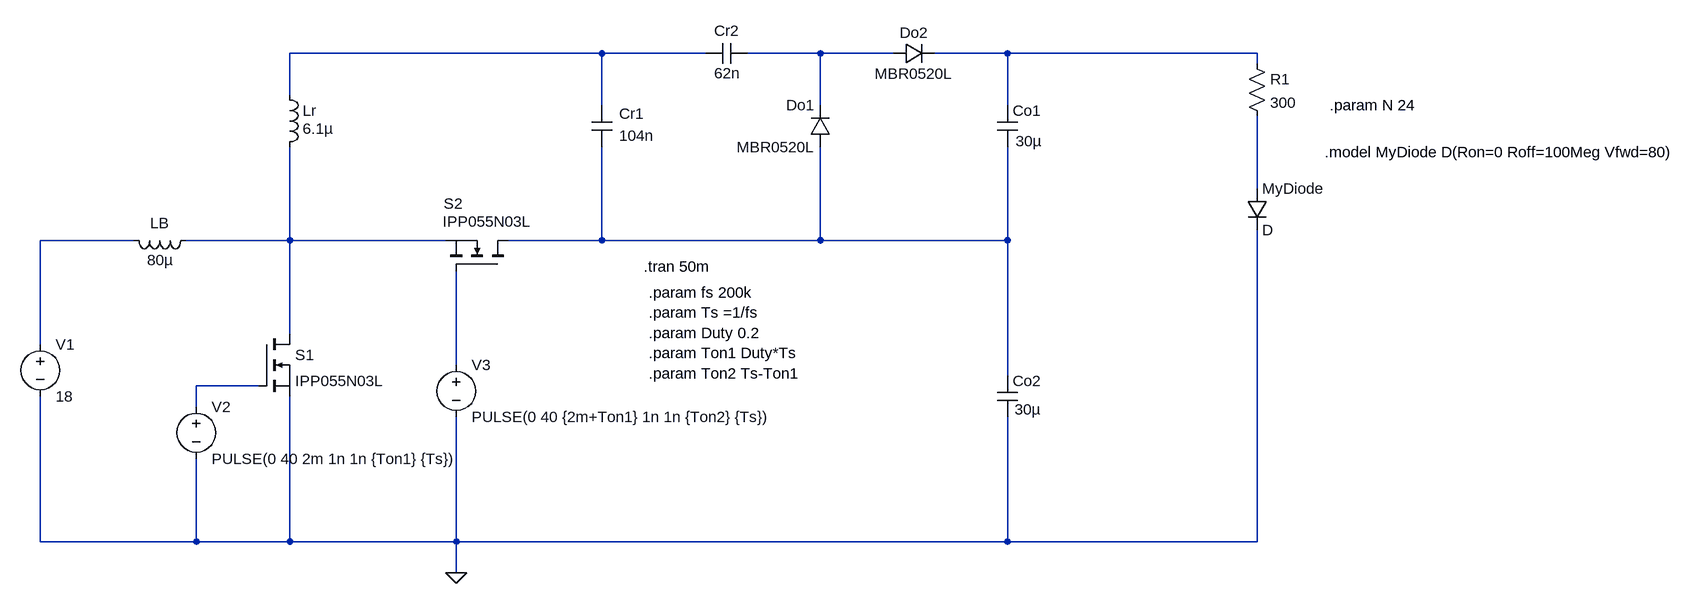
[diagram p0: schematic reale.asc]
reale.asc, the LTspice schematic file:
Version 4.1
SHEET 1 2452 2144
WIRE 352 -128 -128 -128
WIRE 512 -128 352 -128
WIRE 688 -128 576 -128
WIRE 800 -128 688 -128
WIRE 976 -128 864 -128
WIRE 1360 -128 976 -128
WIRE 1360 -112 1360 -128
WIRE -128 -64 -128 -128
WIRE 352 -48 352 -128
WIRE 688 -48 688 -128
WIRE 976 -48 976 -128
WIRE 1360 80 1360 -32
WIRE -368 160 -512 160
WIRE -128 160 -128 16
WIRE -128 160 -288 160
WIRE 112 160 -128 160
WIRE 352 160 352 16
WIRE 352 160 208 160
WIRE 688 160 688 16
WIRE 688 160 352 160
WIRE 976 160 976 16
WIRE 976 160 688 160
WIRE -128 304 -128 160
WIRE -512 320 -512 160
WIRE 128 352 128 208
WIRE 976 368 976 160
WIRE -176 384 -272 384
WIRE -272 416 -272 384
WIRE -512 624 -512 400
WIRE -272 624 -272 496
WIRE -272 624 -512 624
WIRE -128 624 -128 400
WIRE -128 624 -272 624
WIRE 128 624 128 432
WIRE 128 624 -128 624
WIRE 976 624 976 432
WIRE 976 624 128 624
WIRE 1360 624 1360 144
WIRE 1360 624 976 624
WIRE 128 672 128 624
FLAG 128 672 0
SYMBOL cap 336 -48 R0
WINDOW 0 43 13 Left 2
WINDOW 3 43 47 Left 2
SYMATTR InstName Cr1
SYMATTR Value 104n
SYMBOL cap 576 -144 R90
WINDOW 0 -3 32 VBottom 2
WINDOW 3 62 31 VBottom 2
SYMATTR InstName Cr2
SYMATTR Value 62n
SYMBOL cap 960 -48 R0
WINDOW 3 29 55 Left 2
SYMATTR Value 30µ
SYMATTR InstName Co1
SYMBOL cap 960 368 R0
WINDOW 3 27 52 Left 2
SYMATTR Value 30µ
SYMATTR InstName Co2
SYMBOL ind -144 -80 R0
WINDOW 3 36 68 Left 2
SYMATTR Value 6.1µ
SYMATTR InstName Lr
SYMBOL ind -272 144 R90
WINDOW 0 5 56 VBottom 2
WINDOW 3 62 55 VBottom 2
SYMATTR InstName LB
SYMATTR Value 80µ
SYMBOL voltage -512 304 R0
WINDOW 123 0 0 Left 0
WINDOW 39 0 0 Left 0
SYMATTR InstName V1
SYMATTR Value 18
SYMBOL diode 704 16 R180
WINDOW 0 24 64 Left 2
WINDOW 3 24 0 Left 2
SYMATTR InstName Do1
SYMATTR Value MBR0520L
SYMBOL nmos -176 304 R0
SYMATTR InstName S1
SYMATTR Value IPP055N03L
SYMBOL nmos 208 208 M270
WINDOW 0 105 99 VLeft 2
WINDOW 3 77 101 VLeft 2
SYMATTR InstName S2
SYMATTR Value IPP055N03L
SYMBOL diode 800 -112 R270
WINDOW 0 32 32 VTop 2
WINDOW 3 0 32 VBottom 2
SYMATTR InstName Do2
SYMATTR Value MBR0520L
SYMBOL voltage -272 400 R0
WINDOW 123 0 0 Left 0
WINDOW 39 0 0 Left 0
SYMATTR InstName V2
SYMATTR Value PULSE(0 40 2m 1n 1n {Ton1} {Ts})
SYMBOL voltage 128 336 R0
WINDOW 123 0 0 Left 0
WINDOW 39 0 0 Left 0
SYMATTR InstName V3
SYMATTR Value PULSE(0 40 {2m+Ton1} 1n 1n {Ton2} {Ts})
SYMBOL diode 1344 80 R0
SYMATTR InstName MyDiode
SYMBOL res 1344 -128 R0
SYMATTR InstName R1
SYMATTR Value 300
TEXT 416 200 Left 2 !.tran 50m
TEXT 424 240 Left 2 !.param fs 200k\n.param Ts =1/fs\n.param Duty 0.2\n.param Ton1 Duty*Ts\n.param Ton2 Ts-Ton1
TEXT 1472 -48 Left 2 !.param N 24
TEXT 1464 24 Left 2 !.model MyDiode D(Ron=0 Roff=100Meg Vfwd=80)

The netlist it stands for:
* reale.asc
Cr1 N001 N007 104n
Cr2 N002 N001 62n
Co1 N003 N007 30µ
Co2 N007 0 30µ
Lr N001 N006 6.1µ
LB N006 N005 80µ
V1 N005 0 18
Do1 N007 N002 MBR0520L
M§S1 N006 N009 0 0 IPP055N03L
M§S2 N007 N008 N006 N006 IPP055N03L
Do2 N002 N003 MBR0520L
V2 N009 0 PULSE(0 40 2m 1n 1n {Ton1} {Ts})
V3 N008 0 PULSE(0 40 {2m+Ton1} 1n 1n {Ton2} {Ts})
D§MyDiode N004 0 D
R1 N003 N004 300
.model D D
.lib standard.dio
.model NMOS NMOS
.model PMOS PMOS
.lib standard.mos
.tran 50m
.param fs 200k
.param Ts =1/fs
.param Duty 0.2
.param Ton1 Duty*Ts
.param Ton2 Ts-Ton1
.param N 24
.model MyDiode D(Ron=0 Roff=100Meg Vfwd=80)
.backanno
.end